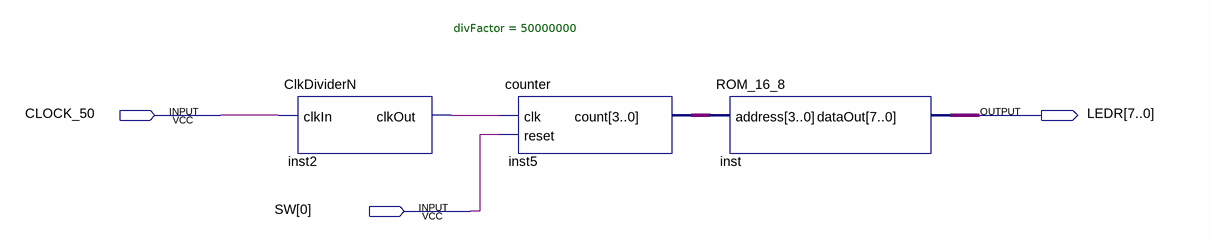
[diagram p0: schematic sheet]
// Quartus schematic ROM_Demo_Counter.bdf as structural Verilog: 3 symbols, 3 pins
module ROM_Demo_Counter (
  input  CLOCK_50,
  input  [0:0] SW,
  output [7:0] LEDR
);

  wire inst2_clkout;
  wire [3:0] inst5_count;

  ClkDividerN #(.divFactor(50000000)) inst2 (.clkIn(CLOCK_50), .clkOut(inst2_clkout));
  counter inst5 (.clk(inst2_clkout), .reset(SW[0]), .count(inst5_count));
  ROM_16_8 inst (.address(inst5_count), .dataOut(LEDR));
endmodule
